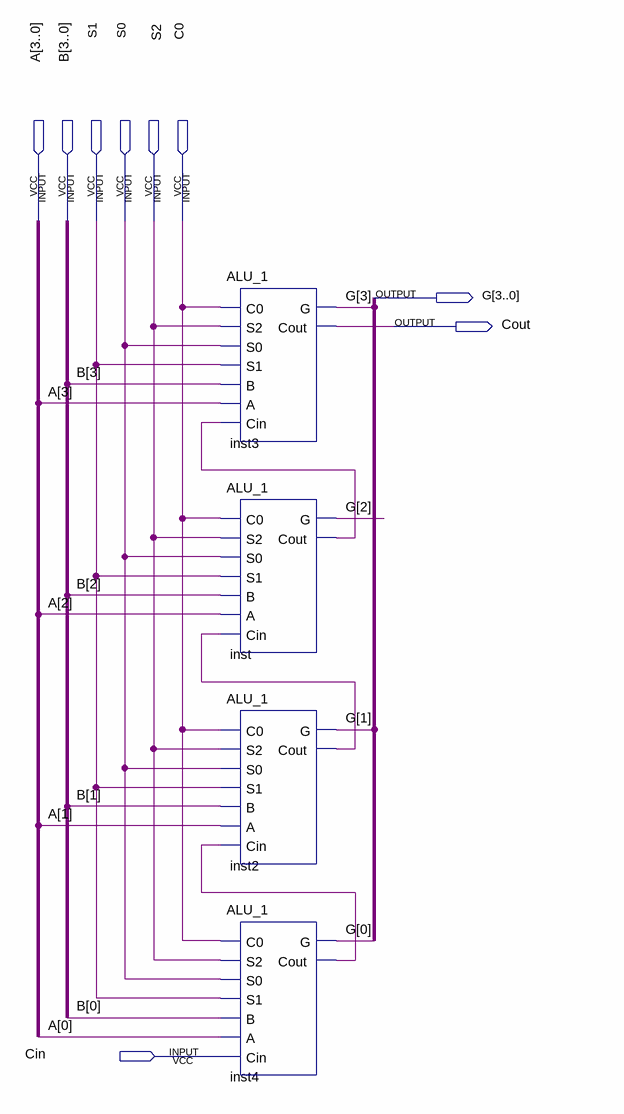
[diagram p0: schematic sheet]
// Quartus schematic ALU.bdf as structural Verilog: 4 symbols, 9 pins
module ALU (
  input  [3:0] A,
  input  [3:0] B,
  input  S1,
  input  S0,
  input  S2,
  input  C0,
  input  Cin,
  output [3:0] G,
  output Cout
);

  wire inst2_cout, inst4_cout, inst_cout;

  ALU_1 inst3 (.C0(C0), .S2(S2), .S0(S0), .S1(S1), .B(B[3]), .A(A[3]), .Cin(inst_cout), .G(G[3]), .Cout(Cout));
  ALU_1 inst (.C0(C0), .S2(S2), .S0(S0), .S1(S1), .B(B[2]), .A(A[2]), .Cin(inst2_cout), .G(G[2]), .Cout(inst_cout));
  ALU_1 inst2 (.C0(C0), .S2(S2), .S0(S0), .S1(S1), .B(B[1]), .A(A[1]), .Cin(inst4_cout), .G(G[1]), .Cout(inst2_cout));
  ALU_1 inst4 (.C0(C0), .S2(S2), .S0(S0), .S1(S1), .B(B[0]), .A(A[0]), .Cin(Cin), .G(G[0]), .Cout(inst4_cout));
endmodule
